# EAGLE design ESP8266_MySensorsGateway_v1.5 (EAGLE 7.5.0)
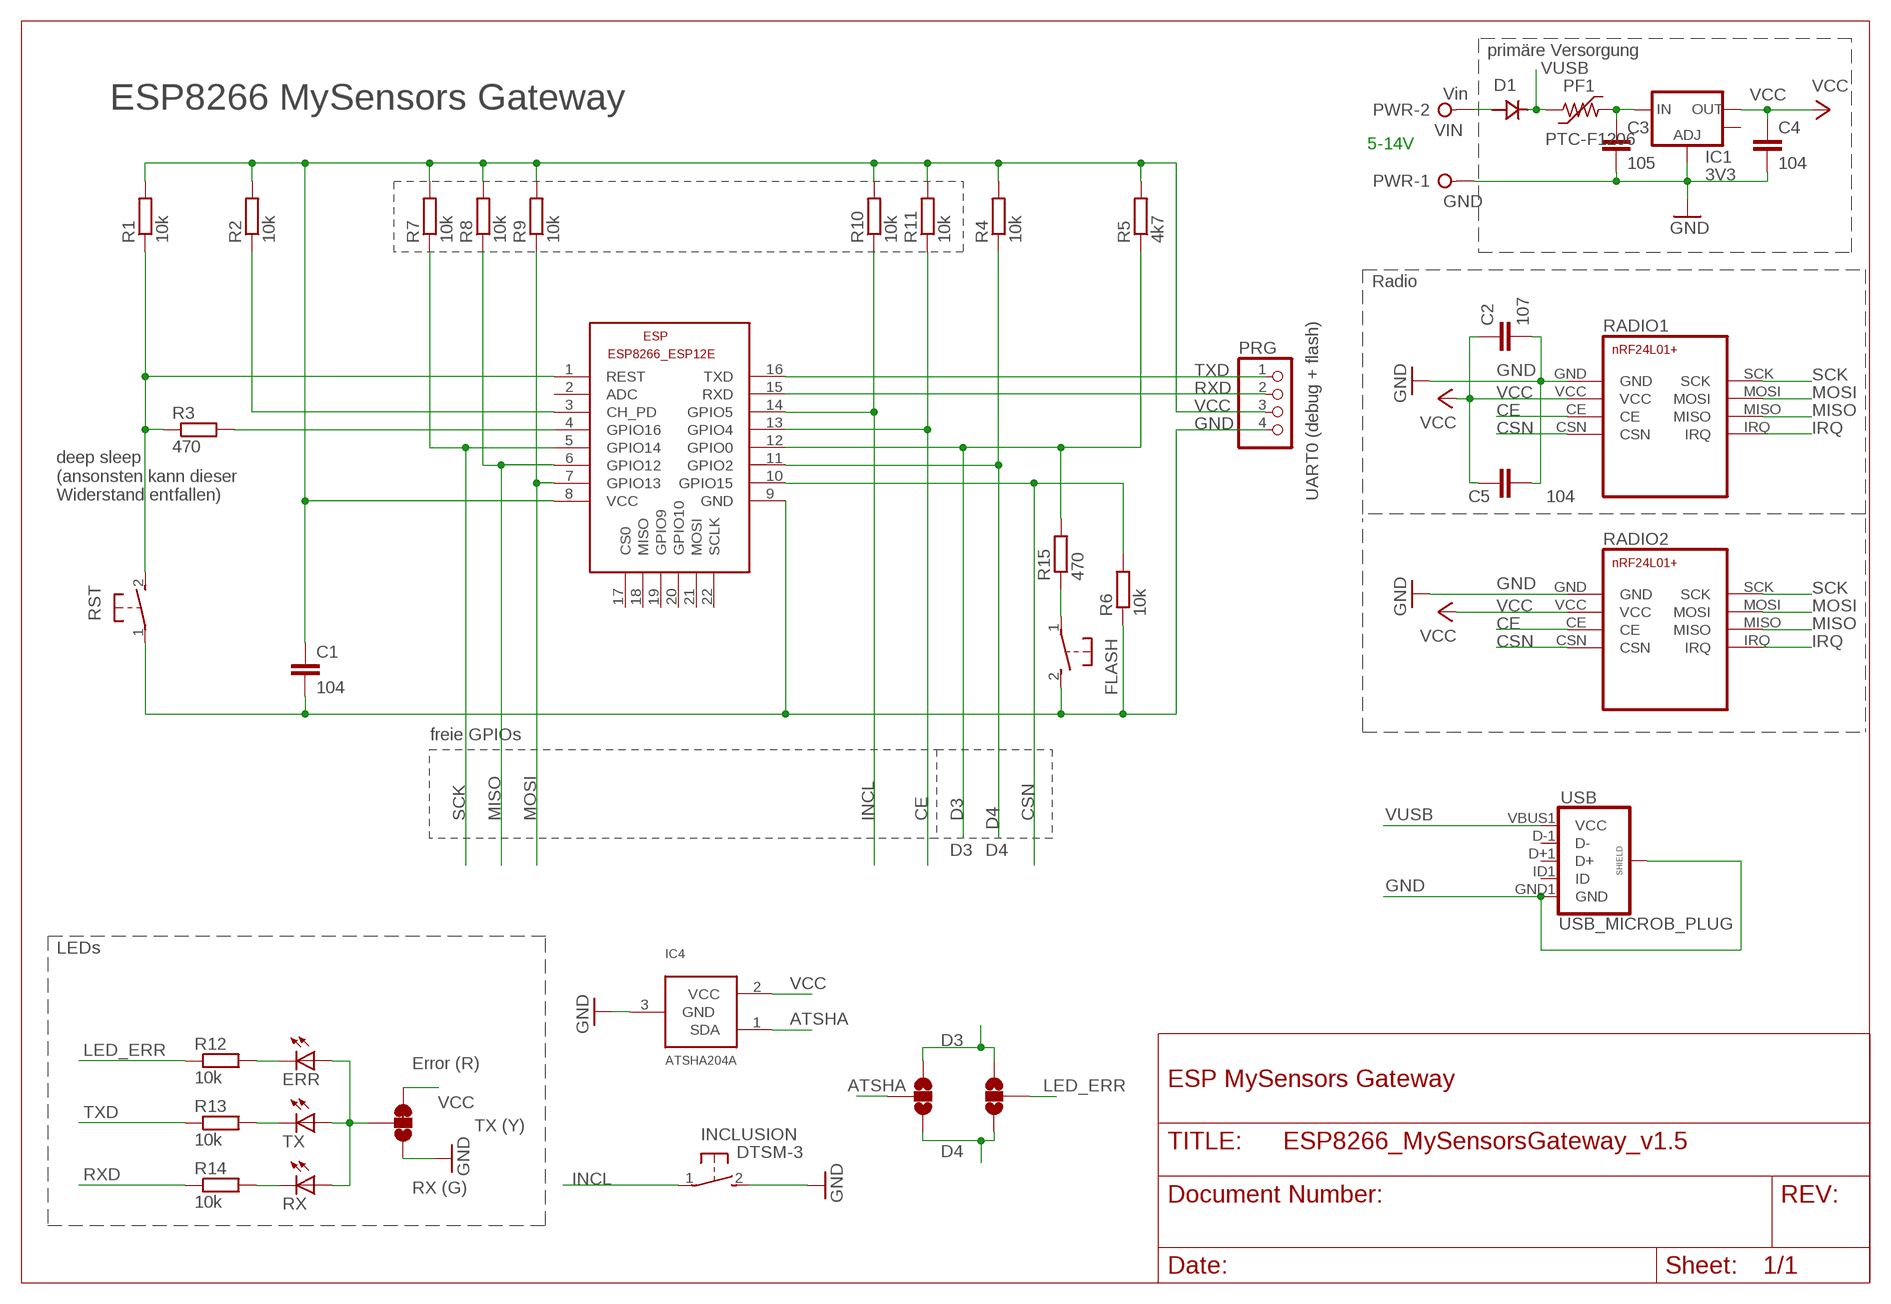
[diagram p0: schematic, sheet 1]

## Parts
C1  104  C-EUC0805  [C0805]
C2  107  C  [MY1210]
C3  105  C-EUC0805  [C0805]
C4  104  C-EUC0805  [C0805]
C5  104  C-EUC0805  [C0805]
D1  SS14  [DO214]
ERR  R  LEDCHIPLED_1206  [CHIPLED_1206]
ESP  µC  ESP8266-12EESP8266-ESP12E  [ESP8266-ESP12E]
FLASH  DTSM-3  [DTSM-3]
IC1  3V3  V_REG_LM1117SOT223  [SOT223]
IC4  ATSHA204A  [SOT23]
INCLUSION  DTSM-3  [DTSM-3]
PF1  PTC-F1206  [F1206]
PRG  PINHD-1X4_S  [1X04]
PWR  Vin  W237-02P  [W237-132]
R1  10k  R-EU_R0805  [R0805]
R2  10k  R-EU_R0805  [R0805]
R3  470  R-EU_R0805  [R0805]
R4  10k  R-EU_R0805  [R0805]
R5  4k7  R-EU_R0805  [R0805]
R6  10k  R-EU_R0805  [R0805]
R7  10k  R-EU_R0805  [R0805]
R8  10k  R-EU_R0805  [R0805]
R9  10k  R-EU_R0805  [R0805]
R10  10k  R-EU_R0805  [R0805]
R11  10k  R-EU_R0805  [R0805]
R12  10k  R-EU_R0805  [R0805]
R13  10k  R-EU_R0805  [R0805]
R14  10k  R-EU_R0805  [R0805]
R15  470  R-EU_R0805  [R0805]
RADIO1  NRF24L01+  [NRF24L01+]
RADIO2  NRF24L01+NRF24L01+MINI  [NRF24L01+MINI]
RST  DTSM-3  [DTSM-3]
RX  G  LEDCHIPLED_1206  [CHIPLED_1206]
SJ1  JUMPER-PAD-3-2OF3_NC_BY_TRACE_SMALL  [PAD-JUMPER-3-2OF3_NC_BY_TRACE_YES_SILK_FULL_BOX]
SJ2  JUMPER-PAD-3-NOYES_SILK  [PAD-JUMPER-3-NO_YES_SILK]
SJ3  JUMPER-PAD-3-NOYES_SILK  [PAD-JUMPER-3-NO_YES_SILK]
TX  Y  LEDCHIPLED_1206  [CHIPLED_1206]
USB  USB_MICROB_PLUG  [USB-B-MICRO-SMD_V03_HOLE]

## Nets
ATSHA: IC4.1(SDA) SJ2.2
CE: ESP.13(GPIO4) R11.1 RADIO1.CE RADIO2.CE
CH_PD: ESP.3(CH_PD) R2.1
CSN: ESP.10(GPIO15) R6.2 RADIO1.CSN RADIO2.CSN
D3: ESP.12(GPIO0) R5.1 R15.2 SJ2.3 SJ3.1
D4: ESP.11(GPIO2) R4.1 SJ2.1 SJ3.3
DEEP_SLEEP: ESP.4(GPIO16) R3.2
GND: C1.2 C2.2 C3.2 C4.2 C5.2 ESP.9(GND) FLASH.2 IC1.1(ADJ) IC4.3(GND) INCLUSION.2 PRG.4 PWR.1 R6.1 RADIO1.GND RADIO2.GND RST.1 SJ1.1 USB.GND1(GND) USB.SHIELD1(SHIELD) USB.SHIELD2(SHIELD) USB.SHIELD3(SHIELD) USB.SLOT1(SHIELD) USB.SLOT2(SHIELD) USB.TAB1(SHIELD) USB.TAB2(SHIELD)
INCL: ESP.14(GPIO5) INCLUSION.1 R10.1
IRQ: RADIO1.IRQ RADIO2.IRQ
L_BASE: ERR.A RX.A SJ1.2 TX.A
LED_ERR: R12.1 SJ3.2
MISO: ESP.6(GPIO12) R8.1 RADIO1.MISO RADIO2.MISO
MOSI: ESP.7(GPIO13) R9.1 RADIO1.MOSI RADIO2.MOSI
N$4: ERR.C R12.2
N$5: R13.2 TX.C
N$6: R14.2 RX.C
N$7: FLASH.1 R15.1
N$10: C3.1 IC1.3(IN) PF1.2
RST: ESP.1(REST) R1.1 R3.1 RST.2
RXD: ESP.15(RXD) PRG.2 R14.1
SCK: ESP.5(GPIO14) R7.1 RADIO1.SCK RADIO2.SCK
TXD: ESP.16(TXD) PRG.1 R13.1
VCC: C1.1 C2.1 C4.1 C5.1 ESP.8(VCC) IC1.2(OUT) IC4.2(VCC) PRG.3 R1.2 R2.2 R4.2 R5.2 R7.2 R8.2 R9.2 R10.2 R11.2 RADIO1.VCC RADIO2.VCC SJ1.3
VIN: D1.ANODE PWR.2
VUSB: D1.CATHODE PF1.1 USB.VBUS1(VCC)
Unconnected: ESP.2(ADC) ESP.17(CS0) ESP.18(MISO) ESP.19(GPIO9) ESP.20(GPIO10) ESP.21(MOSI) ESP.22(SCLK) IC1.4(OUT) USB.D+1(D+) USB.D-1(D-) USB.ID1(ID)

## Notes on the sheet
- primäre Versorgung
- ESP8266 MySensors Gateway
- 5-14V
- Radio
- deep sleep
  (ansonsten kann dieser 
  Widerstand entfallen)
- UART0 (debug + flash)
- freie GPIOs
- D3 | D4
- LEDs
- Error (R)
- ESP MySensors Gateway
- TX (Y)
- RX (G)

## Library data of the parts
C1 C3-C5 = resistor:C-EU: CAPACITOR, European symbol
C2 = my:C: CAPACITOR, European symbol
D1 = ihpcb-diode:SS14
ERR RX TX = led:LED: LED OSRAM: - CHIPLED LG R971, LG N971, LY N971, LG Q971, LY Q971, LO R971, LY R971 LH N974, LH R974 LS Q976, LO Q976, LY Q976 LO Q996 - Hyper CHIPLED LW Q18S LB Q993, LB Q99A, LB R99A - SideLED LS A670, LO A670, LY A670, LG A670, LP A670 LB A673, LV A673, LT A673, LW A673 LH A674 LY A675 LS A676, LA A676, LO A676, LY A676, LW A676 LS A679, LY A679, LG A679 - Hyper Micro SIDELED® LS Y876, LA Y876, LO Y876, LY Y876 LT Y87S - SmartLED LW L88C, LW L88S LB L89C, LB L89S, LG L890 LS L89K, LO L89K, LY L89K LS L896, LA L896, LO L896, LY L896 - TOPLED LS T670, LO T670, LY T670, LG T670, LP T670 LSG T670, LSP T670, LSY T670, LOP T670, LYG T670 LG T671, LOG T671, LSG T671 LB T673, LV T673, LT T673, LW T673 LH T674 LS T676, LA T676, LO T676, LY T676, LB T676, LH T676, LSB T676, LW T676 LB T67C, LV T67C, LT T67C, LS T67K, LO T67K, LY T67K, LW E67C LS E67B, LA E67B, LO E67B, LY E67B, LB E67C, LV E67C, LT E67C LW T67C LS T679, LY T679, LG T679 LS T770, LO T770, LY T770, LG T770, LP T770 LB T773, LV T773, LT T773, LW T773 LH T774 LS E675, LA E675, LY E675, LS T675 LS T776, LA T776, LO T776, LY T776, LB T776 LHGB T686 LT T68C, LB T68C - Hyper Mini TOPLED® LB M676 - Mini TOPLED Santana® LG M470 LS M47K, LO M47K, LY M47K Source: http://www.osram.convergy.de LUXEON: - LUMILED® LXK2-PW12-R00, LXK2-PW12-S00, LXK2-PW14-U00, LXK2-PW14-V00 LXK2-PM12-R00, LXK2-PM12-S00, LXK2-PM14-U00 LXK2-PE12-Q00, LXK2-PE12-R00, LXK2-PE12-S00, LXK2-PE14-T00, LXK2-PE14-U00 LXK2-PB12-K00, LXK2-PB12-L00, LXK2-PB12-M00, LXK2-PB14-N00, LXK2-PB14-P00, LXK2-PB14-Q00 LXK2-PR12-L00, LXK2-PR12-M00, LXK2-PR14-Q00, LXK2-PR14-R00 LXK2-PD12-Q00, LXK2-PD12-R00, LXK2-PD12-S00 LXK2-PH12-R00, LXK2-PH12-S00 LXK2-PL12-P00, LXK2-PL12-Q00, LXK2-PL12-R00 Source: www.luxeon.com KINGBRIGHT: KA-3528ASYC Source: www.kingbright.com
ESP = ESP8266-ESP12E:ESP8266-12E: ESP8266-12E with additional I/O and GPIO04/05 corrected The author cannot warrant that this library is free from error or will meet your specific requirements. Created by PuceBaboon.com. Komagane, Nagano, JAPAN
FLASH INCLUSION RST = mechanics:DTSM-3: Diptronics SMD button 6x3.5 mm
IC1 = SparkFun-PowerIC:V_REG_LM1117: Voltage Regulator LM1117 Standard adjustable voltage regulator but in SMD form. Spark Fun Electronics SKU : COM-00595; PROD_ID: VREG-08170
IC4 = Sensor:ATSHA204A
PF1 = polyswitch:PTC-: POLYSWITCH Polyswitch Resetable Fuses
PRG = my:PINHD-1X4_S: PIN HEADER
PWR = my:W237-02P: WAGO SREW CLAMP; OC_FARNELL: unknown; OC_NEWARK: unknown
R1-R11 R15 = resistor:R-EU_: RESISTOR, European symbol
R12-R14 = rcl:R-EU_: RESISTOR, European symbol
RADIO1 RADIO2 = my:NRF24L01+: nRF24L01+ Transceiver Module
SJ1 = SparkFun-Passives:JUMPER-PAD-3-2OF3_NC_BY_TRACE
SJ2 SJ3 = SparkFun-Passives:JUMPER-PAD-3-NO
USB = my:USB_MICROB_PLUG: USB Micro-B connectors Some male, some female. Watch your step!

## Net classes
1 Power: width 0.406 mm

## Board
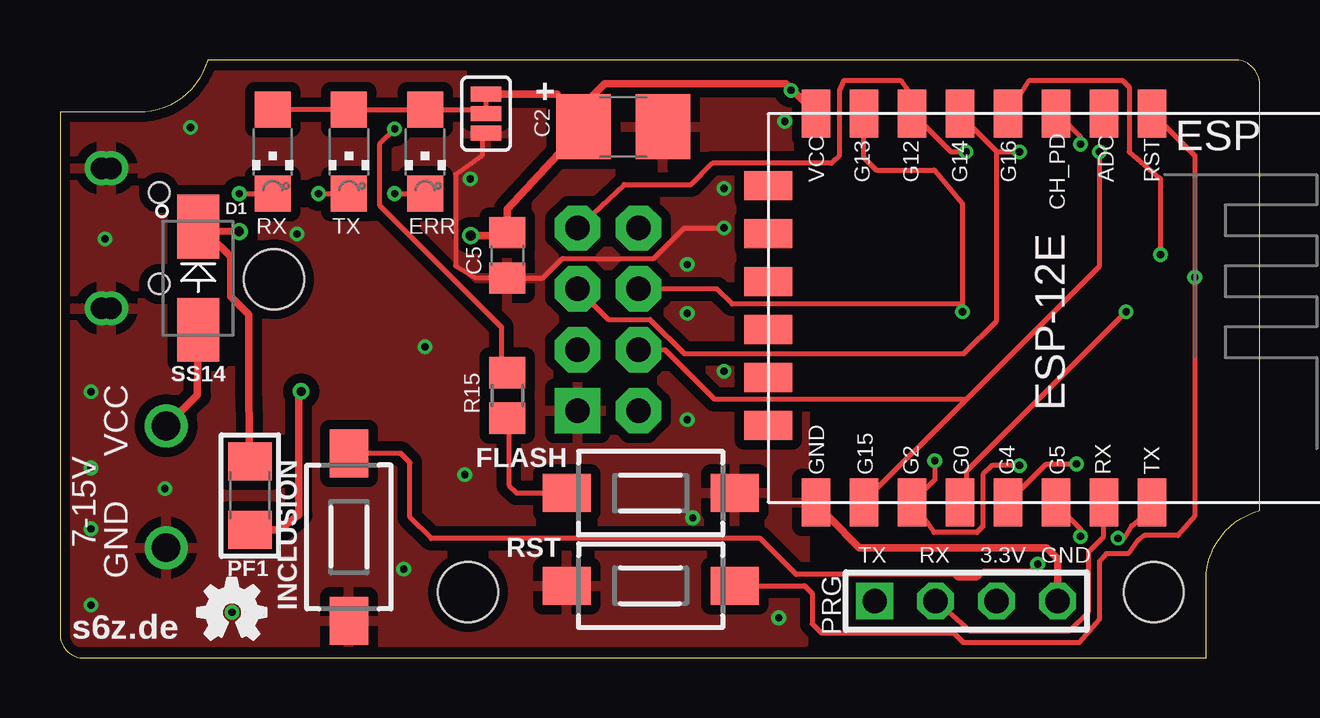
[diagram p1: board, top side]
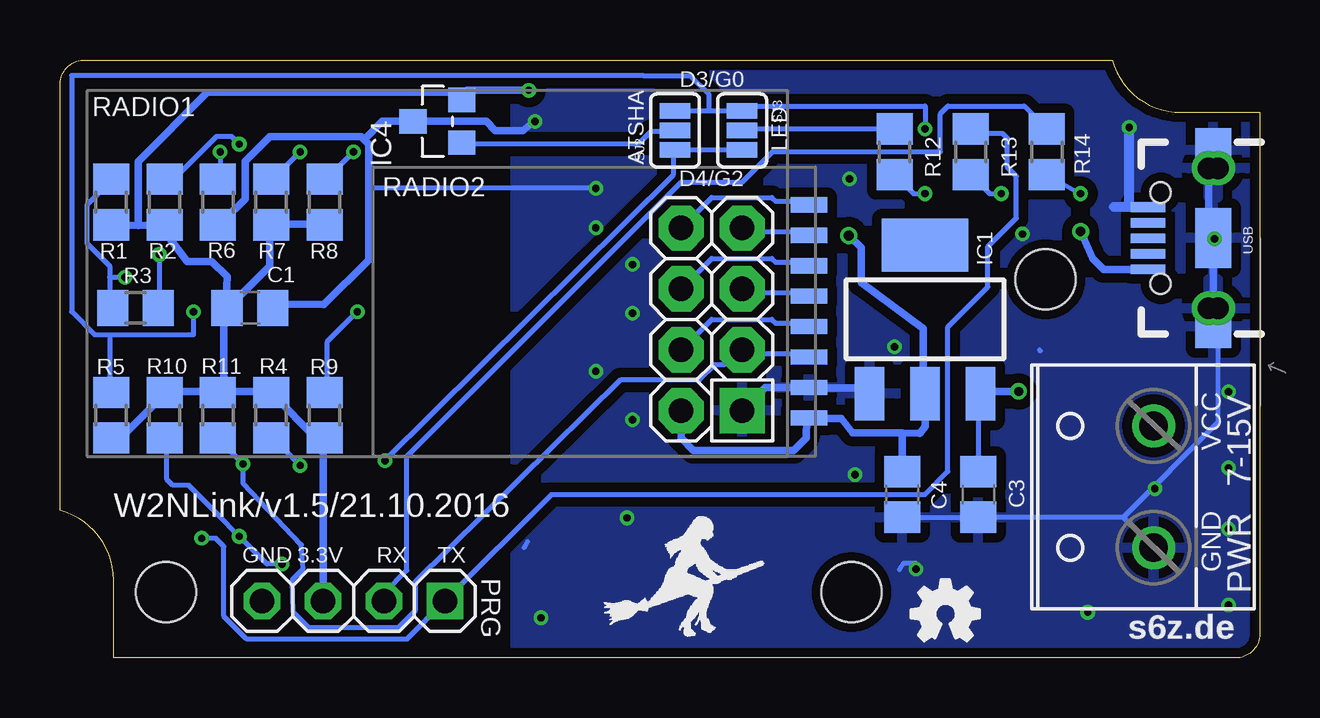
[diagram p2: board, bottom side, seen from below]

Size 49.99 x 24.94 mm. Coordinates in mm from the lower left corner, seen from the top.
Outline: 49.99,6.15 49.99,23.94 arc90 48.94,24.94 6.15,24.94 arc-75 3.25,22.75 0,22.75 0,1 arc90 1,0 47.75,0 47.75,3.25 arc-75 49.99,6.15
Copper layers (1*16): Top 0.035mm / dielectric 1.5mm / Bottom 0.035mm
Design rules "dirtypcbs_v1.0 *": minimum track width 8mil, minimum drill 12mil, track to track 6mil, track to pad 6mil, pad to pad 6mil, via to via 6mil, smd to smd 0mil, copper to edge 10mil, drill to drill 10mil, minimum pad ring 10mil, minimum via ring 6mil, stop-mask expansion 2mil, vias tented up to drill 25mil, thermal gap 16mil
Holes 2.5 mm at 17,2.75 45.57,2.75 8.92,15.79

### Footprints (pad centres in the part's own frame; a part is rotated, then mirrored left to right if it is on the bottom)
C0805 = smd 1.3 x 1.5: 1 -0.95,0; 2 0.95,0
MY1210 = smd 2.286 x 2.7: 1 -1.654,0; 2 1.654,0
DO214 = smd 2.65 x 1.75: ANODE -2.15,0; CATHODE 2.15,0
CHIPLED_1206 = smd 1.5 x 1.5: A 0,-1.75; C 0,1.75
ESP8266-ESP12E = smd 2 x 1.2: 1 0,16; 2 0,14; 3 0,12; 4 0,10; 5 0,8; 6 0,6; 7 0,4; 8 0,2; 9 16.2,2; 10 16.2,4; 11 16.2,6; 12 16.2,8; 13 16.2,10; 14 16.2,12; 15 16.2,14; 16 16.2,16 | smd 1.2 x 2: 17 11,0; 18 3,0; 19 5,0; 20 13,0; 21 7,0; 22 9,0
DTSM-3 = smd 2 x 1.6: 1 -3.494,0; 2 3.494,0
SOT223 = smd 1.219 x 2.235: 1 -2.311,-3.099; 2 0,-3.099; 3 2.311,-3.099 | smd 3.6 x 2.2: 4 0,3.099
SOT23 = smd 1.016 x 1.143: 1 -0.889,-1.016; 2 0.889,-1.016; 3 0,1.016
F1206 = smd 1.6 x 1.803: 1 -1.429,0; 2 1.429,0
1X04 = drill 1.016 square: 1 -3.81,0 | drill 1.016 octagon: 2 -1.27,0; 3 1.27,0; 4 3.81,0
W237-132 = drill 1.194: 1 -2.54,-0.635; 2 2.54,-0.635
R0805 = smd 1.3 x 1.5: 1 -0.95,0; 2 0.95,0
NRF24L01+ = drill 1.016 pad 1.88 octagon: CE -11.43,1.27; CSN -8.89,1.27; IRQ -8.89,-3.81; MISO -11.43,-3.81; MOSI -8.89,-1.27; SCK -11.43,-1.27; VCC -8.89,3.81 | drill 1.016 pad 1.88 square: GND -11.43,3.81
NRF24L01+MINI = smd 0.635 x 1.524: CE -1.575,-7.861; CSN -0.305,-7.861; GND -2.845,-7.861; IRQ 4.775,-7.861; MISO 3.505,-7.861; MOSI 2.235,-7.861; SCK 0.965,-7.861; VCC -4.115,-7.861
PAD-JUMPER-3-2OF3_NC_BY_TRACE_YES_SILK_FULL_BOX = smd 0.635 x 1.27: 1 -0.813,0; 2 0,0; 3 0.813,0
PAD-JUMPER-3-NO_YES_SILK = smd 0.635 x 1.27: 1 -0.813,0; 2 0,0; 3 0.813,0
USB-B-MICRO-SMD_V03_HOLE = smd 1.45 x 0.4: D+1 2.725,0; D-1 2.725,0.65; GND1 2.725,-1.3; ID1 2.725,-0.65; VBUS1 2.725,1.3 | smd 1.5 x 1.8: SHIELD1 0,3.685; SHIELD2 0,-3.685 | smd 1.5 x 2.5: SHIELD3 0,0 | drill 0.9: SLOT1 -0.2,2.921; SLOT2 -0.2,-2.921; TAB1 0.2,2.921; TAB2 0.2,-2.921 | hole 0.85: 2.2,1.9; 2.2,-1.9

### Placement (x,y rotation side)
C1  42.07,14.6 0 bottom
C2  23.47,22.15 0 top
C3  11.72,6.82 270 bottom
C4  14.9,6.82 270 bottom
C5  18.64,16.79 270 top
D1  5.75,15.84 90 top
ERR  15.21,21.11 180 top
ESP  29.5,22.69 270 top
FLASH  24.61,6.88 0 top
IC1  13.94,14.12 0 bottom
IC4  34.26,22.38 90 bottom
INCLUSION  12.04,5.04 270 top
PF1  7.91,6.77 270 top
PRG  37.76,2.37 180 bottom
PWR  5.05,7.14 90 bottom
R1  47.85,19.01 270 bottom
R2  45.63,19.01 270 bottom
R3  46.84,14.6 0 bottom
R4  41.19,10.12 90 bottom
R5  47.85,10.12 270 bottom
R6  43.41,19.01 90 bottom
R7  41.19,19.01 270 bottom
R8  38.96,19.01 270 bottom
R9  38.96,10.12 270 bottom
R10  45.63,10.12 90 bottom
R11  43.41,10.12 90 bottom
R12  15.21,21.11 270 bottom
R13  12.04,21.11 270 bottom
R14  8.86,21.11 270 bottom
R15  18.64,10.95 90 top
RADIO1  32.99,14.12 180 bottom
RADIO2  26.64,14.12 90 bottom
RST  24.61,3.01 0 top
RX  8.86,21.11 180 top
SJ1  17.75,22.69 90 top
SJ2  24.36,22 90 bottom
SJ3  21.56,22 270 bottom
TX  12.04,21.11 180 top
U$1  [OSHW_FILLX100_NOTEXT]  14.51,0.72 0 bottom
U$2  [OSHW_FILLX100_NOTEXT]  5.75,0.78 0 top
USB  1.93,17.5 180 bottom

### Tracks (layer width: path | path; a pad name or v marks a point on that pad's centre or on a via)
ATSHA
  Bottom 0.203: 33.5,21.23 IC4.1 32.99,21.43 25.9,21.43 25.37,21.95 24.42,21.95 SJ2.2
CE  (via drill 0.3)
  Top 0.203: v42.36,8.09 41.09,8.09 ESP.13
  Bottom 0.203: R11.1 43.31,9.04 v42.36,8.09 42.36,7.28 39.93,4.72 39.85,3.71 40.07,3.49 40.3,3.25 40.27,1.9 39.63,1.26 35.88,1.26 35.19,1.96 35.19,3.17 26.64,11.58 23.34,11.58 22.71,12.22 22.33,12.22 22.07,12.47 RADIO1.CE 21.41,12.69 18.87,12.69 RADIO2.CE
CH_PD  (via drill 0.3)
  Top 0.203: v42.52,21.43 42.52,21.74 41.57,22.7 ESP.3
  Bottom 0.203: v42.52,21.43 42.84,21.74 43.47,21.74 45.22,20 45.54,20 R2.1
CSN  (via drill 0.3)
  Top 0.203: v43.31,21.11 43.31,16.35 37.76,10.79 | 37.76,10.79 33.47,6.5 ESP.10 | RADIO1.CSN 25.22,12.85 27.28,10.79 37.76,10.79
  Bottom 0.203: RADIO1.CSN 22.83,14.12 20.33,14.12 20.17,13.96 18.87,13.96 RADIO2.CSN | v43.31,21.11 43.31,20 R6.2
D3  (via drill 0.3)
  Top 0.203: v13.94,22.06 13.31,21.43 13.31,18.88 18.39,13.81 18.39,11.9 R15.2 | v44.42,14.44 37.76,7.77 37.76,6.5 ESP.12
  Bottom 0.203: 47.92,13.49 47.92,11.27 R5.1 | 47.92,13.49 48.55,13.49 49.5,14.44 49.5,24.28 25.69,24.28 23.72,24.28 22.96,23.52 22.96,22.81 | v13.94,22.06 13.94,23.01 21.56,23.01 SJ3.1 22.96,22.81 | v44.42,14.44 44.42,13.49 47.92,13.49 | 22.96,22.81 SJ2.3
D4  (via drill 0.3)
  Top 0.203: v39.98,8.03 38.84,8.03 38.46,7.65 38.46,5.49 38.2,5.23 36.42,5.23 36.19,5.57 35.66,6.34 ESP.11 36.45,7.44 v36.45,8.23
  Bottom 0.203: SJ3.3 SJ2.1 24.42,21.11 24.42,20.15 v36.45,8.23 | R4.1 41.12,9.17 v39.98,8.03
DEEP_SLEEP  (via drill 0.3)
  Top 0.203: v45.85,16.82 45.85,20 44.55,21.11 44.55,23.81 44.27,24.09 40.39,24.09 ESP.4
  Bottom 0.203: v45.85,16.82 45.85,14.6 R3.2
GND  (via drill 0.3)
  Top 0.203: 17.75,21.9 SJ1.1 17.75,21.74 17.6,21.58 17.6,20.95 16.48,20.15 16.48,16.35 17.28,15.87 18.55,15.87 C5.2 20.11,15.84 20.93,16.66 24.74,16.66 26.01,17.93 v27.66,17.93 | 31.57,6.34 ESP.9 | 31.6,5.87 32.04,5.87
  Top 0.305: 31.57,6.34 32.04,5.87 | 32.04,5.87 33.31,4.6 41.11,4.6 41.57,4.14 PRG.4 | 32.04,5.87 ESP.9
  Bottom 0.203: C3.2 C4.2 | 5.69,5.87 C3.2 | PWR.1 5.69,5.87 | C3.2 | 1.72,13.49 1.72,9.84 5.69,5.87 | 16.48,11.27 16.33,11.11 IC1.1 | 18.71,11.27 RADIO2.GND | 15.02,3.69 14.83,3.96 14.33,3.96 v14.33,3.71 | 40.93,14.76 C1.2 | 43.15,18.25 R6.1 | 30.52,4.85 30.65,4.6 | 9.18,12.85 9.14,12.81 | v27.66,19.58 37,19.58 37.12,19.71
  Bottom 0.305: 16.48,11.27 18.71,11.27 | 40.93,14.76 38.99,14.73 37.12,16.6 37.12,19.71 37.12,21.43 37.31,21.62 | 37.31,21.62 37.44,21.74 41.25,21.74 42.28,20.71 42.28,19.13 43.15,18.25 | USB.GND1 6.07,18.8 | RADIO2.GND 20.6,11.28 RADIO1.GND | 37.31,21.62 36.55,22.38 IC4.3 32.23,22.38 31.85,22 30.71,22 v30.2,22.38 | USB.SLOT1 1.93,14.78 USB.SHIELD3 2.13,17.7 USB.TAB2
  Bottom 0.406: 6.07,18.8 6.07,18.82 5.44,18.82 v5.44,22.12 | USB.TAB1 1.93,13.88 USB.SHIELD1 | USB.TAB2 1.93,21.13 USB.SHIELD2
  other vias: 17.09,19.98 15.21,12.98 26.14,16.41 26.14,14.38 27.66,11.96 16.87,7.65 26.14,9.93 29.95,1.68 7.16,1.91 1.88,17.48 1.3,2.21 1.3,5.38 1.3,7.92 1.3,11.1 4.37,7.06 26.36,5.84 9.88,17.68
  pour Bottom (isolate 0.406): -0.28,24.31 31.03,24.31 31.03,0.53 -0.28,0.53
  pour Top (isolate 0.406): -0.28,24.31 31.03,24.31 31.03,0.66 -0.28,0.66
INCL  (via drill 0.3)
  Top 0.203: v42.52,5.07 42.52,5.39 41.57,6.34 ESP.14 | v40.74,3.92 40.44,3.61 38.47,3.61 38.19,3.33 37.42,3.33 37.26,3.49 30.68,3.49 29.18,4.98 15.47,4.98 14.58,5.87 14.58,8.15 14.2,8.53 INCLUSION.1
  Bottom 0.203: R10.1 45.54,9.04 45.54,7.45 45.28,7.2 44.61,7.2 43.41,5.99 v42.52,5.07 41.36,3.92 v40.74,3.92
IRQ
  Bottom 0.203: RADIO1.IRQ 22.83,19.2 20.33,19.2 20.17,19.04 18.87,19.04 RADIO2.IRQ
L_BASE
  Top 0.203: ERR.A 17.75,22.85 SJ1.2 | TX.A RX.A | TX.A ERR.A | ERR.A | TX.A
LED_ERR
  Bottom 0.203: R12.1 21.5,22.06 SJ3.2
MISO  (via drill 0.3)
  Top 0.203: v37.76,21.11 37.12,21.11 35.53,22.7 ESP.6 35.38,22.7 35.44,23.52 35.06,24.06 35.03,24.09 32.68,24.09 32.49,23.65 32.49,20.96 32.16,20.62 27.19,20.62 27.18,20.63 26.3,19.74 23.5,19.74 RADIO1.MISO
  Bottom 0.203: v37.76,21.11 38.87,20 R8.1 | RADIO1.MISO 21.41,17.77 18.87,17.77 RADIO2.MISO
MOSI  (via drill 0.3)
  Top 0.203: 37.6,14.76 37.6,18.95 36.42,20.35 34.01,20.35 33.47,20.89 33.47,22.7 ESP.7 | 37.6,14.76 v37.6,14.44 | RADIO1.MOSI 27.37,15.39 28.01,14.76 37.6,14.76
  Bottom 0.203: RADIO1.MOSI 22.83,16.66 20.33,16.66 20.17,16.5 18.87,16.5 RADIO2.MOSI | v37.6,14.44 38.87,13.17 38.87,11.11 R9.1
N$4  (via drill 0.3)
  Top 0.203: v13.94,19.36 ERR.C
  Bottom 0.203: v13.94,19.36 14.42,19.36 R12.2
N$5  (via drill 0.3)
  Top 0.203: v10.77,19.36 TX.C
  Bottom 0.203: v10.77,19.36 11.25,19.36 R13.2
N$6  (via drill 0.3)
  Top 0.203: v7.47,19.36 RX.C
  Bottom 0.203: R14.2 v7.47,19.36
N$7
  Top 0.203: R15.1 18.71,9.99 18.71,7.2 19.02,6.88 FLASH.1
N$10  (via drill 0.38)
  Top 0.305: PF1.2 9.12,5.34 9.96,5.97 9.96,10.85 v10.05,11.12
  Bottom 0.203: C3.1 11.72,10.95 IC1.3 11.56,11.11
  Bottom 0.305: 11.56,11.11 10.02,11.11 v10.05,11.12
RST  (via drill 0.3)
  Top 0.203: ESP.1 45.54,22.7 47.28,20.95 v47.28,15.87 47.28,5.93 46.58,5.11 45.19,5.11 44.91,4.9 44.5,4.34 43.59,4.34 43.31,4.04 43.31,1.6 42.48,0.65 37.63,0.65 37.24,1.04 31.72,1.04 31.34,1.42 31.34,2.69 31.03,3.01 RST.2
  Bottom 0.203: 47.92,15.87 47.92,16.35 48.87,17.3 48.87,18.88 47.92,19.84 R1.1 | 47.92,15.87 47.92,14.6 R3.1 | v47.28,15.87 47.92,15.87
RXD
  Top 0.203: ESP.15 43.47,6.34 43.48,5.05 42.86,4.43 42.86,1.93 42.04,1.12 37.92,1.12 PRG.2
  Bottom 0.203: PRG.2 36.49,2.69 35.53,3.64 35.53,8.41 24.1,19.84 21.56,19.84 20.29,21.11 13.31,21.11 13.31,22.7 12.99,23.01 9.82,23.01 R14.1
SCK  (via drill 0.3)
  Top 0.203: 39.03,21.11 v39.98,21.11 | 39.03,21.11 37.44,22.7 ESP.5 | 39.03,21.11 39.03,14.06 37.66,12.69 26.01,12.69 24.58,14.12 22.83,14.12 RADIO1.SCK
  Bottom 0.203: v39.98,21.11 41.09,20 R7.1 | RADIO1.SCK 21.41,15.23 18.87,15.23 RADIO2.SCK
TXD  (via drill 0.3)
  Top 0.203: v44.08,4.99 44.34,4.99 44.65,5.51 45.28,6.04 ESP.16
  Bottom 0.203: R13.1 12.04,21.9 11.25,21.87 10.71,21.87 10.52,21.68 10.52,20.47 10.13,20.09 10.13,18.34 11.33,17.15 11.33,15.47 12.99,13.81 12.99,7.77 13.94,6.82 29.5,6.82 PRG.1 35.53,0.79 42.2,0.79 43.15,1.74 43.15,4.65 43.5,4.99 v44.08,4.99
VCC  (via drill 0.3, 0.41)
  Top 0.203: C5.1 18.64,17.68 18.71,17.62
  Top 0.305: v17.12,17.62 18.71,17.62 | C5.1 18.64,18.72 C2.1 | SJ1.3 20.71,23.51 C2.1 | C2.1 22.07,23.31 22.71,23.95 30.24,23.95 30.5,23.7 | 30.5,23.7 ESP.8 | v30.45,23.67 30.5,23.7
  Bottom 0.203: 39.34,9.2 39.03,9.2 R9.2 39.03,9.04 | 41.09,10.95 R4.2 41.25,11.11 | 39.03,18.09 R8.2 | 41.09,18.09 R7.2 41.25,17.93 | 43.47,11.11 R11.2 43.31,11.11 43.15,11.27 | 45.54,11.11 R10.2 45.69,10.95 | 43.15,14.6 C1.1 | 47.44,9.2 47.76,9.2 R5.2 | 42.52,15.07 43,14.6 C1.1 | 42.52,15.07 43.06,15.07 | 45.54,17.93 R2.2 45.69,18.06 | 42.52,15.07 C1.1 | 13.94,10.95 IC1.2 14.26,11.34 14.26,11.58 14.07,11.58 | 18.71,9.99 RADIO2.VCC 18.87,9.99 | R1.2
  Bottom 0.305: 41.09,10.95 39.34,9.2 | 41.09,18.09 39.03,18.09 | 45.54,11.11 43.47,11.11 | 43.15,11.27 43.15,14.6 | 45.69,10.95 47.44,9.2 | 41.25,17.93 41.25,16.35 42.52,15.07 | 43.06,15.07 43.03,15.9 43.66,16.54 44.68,16.54 45.54,17.65 45.54,17.93 | 43.31,11.11 41.25,11.11 | 39.03,9.04 39.01,2.44 PRG.3 | 13.94,10.95 13.94,9.66 14.15,9.37 14.9,9.39 | 14.9,9.39 C4.1 | 18.71,9.99 17.44,9.99 16.96,9.39 14.9,9.39 | RADIO1.VCC 24.1,9.17 23.6,8.66 19.41,8.66 18.9,9.17 18.87,9.99 | 14.07,11.58 14.01,11.9 14.01,13.74 16.61,15.65 16.61,17.11 v17.12,17.62 | 45.69,18.06 46.74,18.03 | 46.74,18.03 R1.2 | 46.74,18.03 46.74,20.7 43.87,23.58 33.68,23.6 33.35,23.27 IC4.2 33.14,23.27 33.14,23.58 33.05,23.67 v30.45,23.67
VIN
  Top 0.305: D1.ANODE 5.73,10.96 PWR.2
VUSB  (via drill 0.41)
  Top 0.305: 6.25,17.6 5.94,17.29 5.94,17.02 5.3,17.77 5.27,17.77 D1.CATHODE | 6.25,17.6 6.45,17.81 v7.46,17.79 | PF1.1 7.86,10.93 7.86,14.31 7.11,15.06 7.11,16.74 6.25,17.6
  Bottom 0.305: USB.VBUS1 6.5,16.2 6.96,16.66 v7.46,17.79

### Text on the board
tPlace: + | VCC | G13 | G12 | G14 | G16 | ADC | RST | CH_PD | VCC | GND | G15 | G2 | G0 | G4 | G5 | RX | TX | 7-15V | TX | RX | 3.3V | GND | GND | PRG | s6z.de
bPlace: D3/G0 | LED | ATSHA | D4/G2 | VCC | 7-15V | W2NLink/v1.5/21.10.2016 | TX | RX | 3.3V | GND | GND | s6z.de
tStop: s6z.de